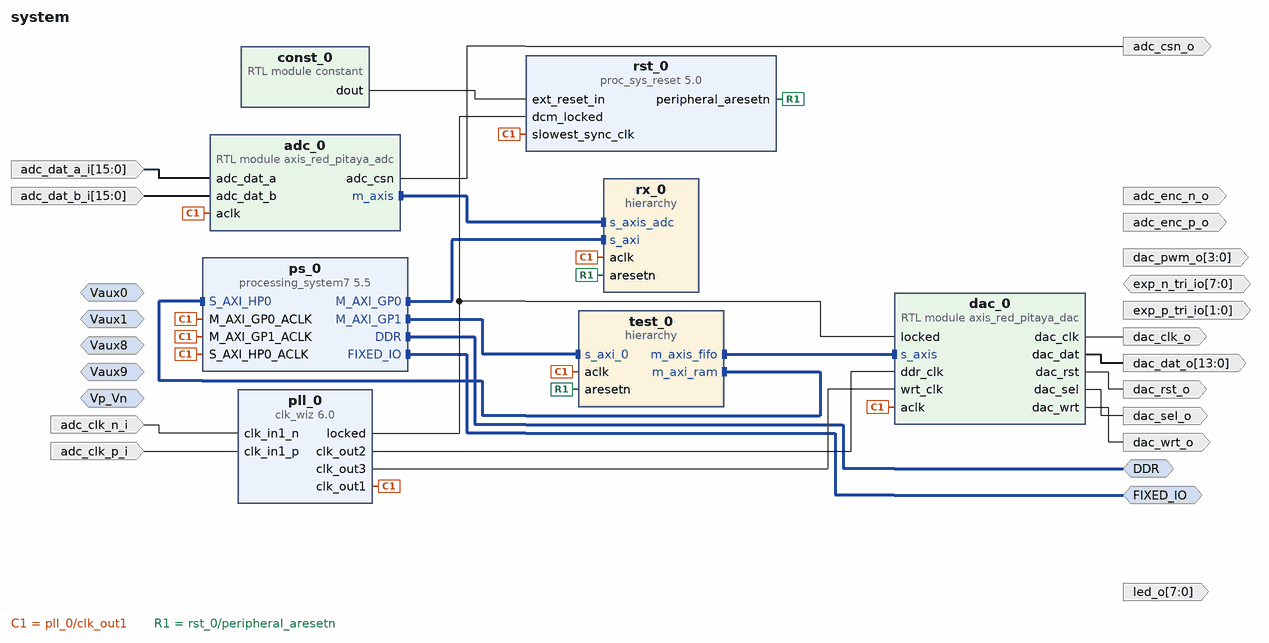
[diagram p0: block diagram of the top level]
# Vivado block design system, xc7z010clg400-1, Vivado 2025.2
create_bd_design system

create_bd_intf_port -mode Slave -vlnv xilinx.com:interface:diff_analog_io_rtl:1.0 Vp_Vn
create_bd_intf_port -mode Slave -vlnv xilinx.com:interface:diff_analog_io_rtl:1.0 Vaux0
create_bd_intf_port -mode Slave -vlnv xilinx.com:interface:diff_analog_io_rtl:1.0 Vaux1
create_bd_intf_port -mode Slave -vlnv xilinx.com:interface:diff_analog_io_rtl:1.0 Vaux9
create_bd_intf_port -mode Slave -vlnv xilinx.com:interface:diff_analog_io_rtl:1.0 Vaux8
create_bd_intf_port -mode Master -vlnv xilinx.com:interface:ddrx_rtl:1.0 DDR
create_bd_intf_port -mode Master -vlnv xilinx.com:display_processing_system7:fixedio_rtl:1.0 FIXED_IO
create_bd_port -dir I -from 15 -to 0 adc_dat_a_i
create_bd_port -dir I -from 15 -to 0 adc_dat_b_i
create_bd_port -dir I adc_clk_p_i
create_bd_port -dir I adc_clk_n_i
create_bd_port -dir O adc_enc_p_o
create_bd_port -dir O adc_enc_n_o
create_bd_port -dir O adc_csn_o
create_bd_port -dir O -from 13 -to 0 dac_dat_o
create_bd_port -dir O dac_clk_o
create_bd_port -dir O dac_rst_o
create_bd_port -dir O dac_sel_o
create_bd_port -dir O dac_wrt_o
create_bd_port -dir O -from 3 -to 0 dac_pwm_o
create_bd_port -dir IO -from 7 -to 0 exp_n_tri_io
create_bd_port -dir O -from 7 -to 0 led_o
create_bd_port -dir O -from 1 -to 0 exp_p_tri_io

create_bd_cell -type ip -vlnv xilinx.com:ip:clk_wiz:6.0 pll_0
set_property -dict [list \
  CONFIG.CLKOUT1_REQUESTED_OUT_FREQ 125.0 \
  CONFIG.CLKOUT1_USED true \
  CONFIG.CLKOUT2_REQUESTED_OUT_FREQ 250.0 \
  CONFIG.CLKOUT2_REQUESTED_PHASE 157.5 \
  CONFIG.CLKOUT2_USED true \
  CONFIG.CLKOUT3_REQUESTED_OUT_FREQ 250.0 \
  CONFIG.CLKOUT3_REQUESTED_PHASE 202.5 \
  CONFIG.CLKOUT3_USED true \
  CONFIG.PRIMITIVE PLL \
  CONFIG.PRIM_IN_FREQ 125.0 \
  CONFIG.PRIM_SOURCE Differential_clock_capable_pin \
  CONFIG.USE_RESET false \
] [get_bd_cells pll_0]
create_bd_cell -type ip -vlnv xilinx.com:ip:processing_system7:5.5 ps_0
set_property -dict [list \
  CONFIG.PCW_APU_PERIPHERAL_FREQMHZ 666.666666 \
  CONFIG.PCW_ENET0_ENET0_IO {MIO 16 .. 27} \
  CONFIG.PCW_ENET0_GRP_MDIO_ENABLE 1 \
  CONFIG.PCW_ENET0_GRP_MDIO_IO {MIO 52 .. 53} \
  CONFIG.PCW_ENET0_PERIPHERAL_ENABLE 1 \
  CONFIG.PCW_ENET0_RESET_ENABLE 0 \
  CONFIG.PCW_ENET_RESET_ENABLE 1 \
  CONFIG.PCW_ENET_RESET_SELECT {Share reset pin} \
  CONFIG.PCW_FPGA0_PERIPHERAL_FREQMHZ 50 \
  CONFIG.PCW_FPGA1_PERIPHERAL_FREQMHZ 50 \
  CONFIG.PCW_GPIO_EMIO_GPIO_ENABLE 1 \
  CONFIG.PCW_GPIO_EMIO_GPIO_IO 64 \
  CONFIG.PCW_GPIO_MIO_GPIO_ENABLE 1 \
  CONFIG.PCW_GPIO_MIO_GPIO_IO MIO \
  CONFIG.PCW_GPIO_PERIPHERAL_ENABLE 1 \
  CONFIG.PCW_I2C0_GRP_INT_ENABLE 0 \
  CONFIG.PCW_I2C0_I2C0_IO {MIO 50 .. 51} \
  CONFIG.PCW_I2C0_PERIPHERAL_ENABLE 1 \
  CONFIG.PCW_I2C_PERIPHERAL_FREQMHZ 111.111115 \
  CONFIG.PCW_I2C_RESET_ENABLE 1 \
  CONFIG.PCW_I2C_RESET_SELECT {Share reset pin} \
  CONFIG.PCW_IMPORT_BOARD_PRESET cfg/red_pitaya.xml \
  CONFIG.PCW_PRESET_BANK1_VOLTAGE {LVCMOS 2.5V} \
  CONFIG.PCW_QSPI_PERIPHERAL_ENABLE 0 \
  CONFIG.PCW_SD0_GRP_CD_ENABLE 1 \
  CONFIG.PCW_SD0_GRP_CD_IO {MIO 46} \
  CONFIG.PCW_SD0_GRP_WP_ENABLE 1 \
  CONFIG.PCW_SD0_GRP_WP_IO {MIO 47} \
  CONFIG.PCW_SD0_PERIPHERAL_ENABLE 1 \
  CONFIG.PCW_SD0_SD0_IO {MIO 40 .. 45} \
  CONFIG.PCW_SDIO_PERIPHERAL_FREQMHZ 100 \
  CONFIG.PCW_SPI0_PERIPHERAL_ENABLE 1 \
  CONFIG.PCW_SPI0_SPI0_IO EMIO \
  CONFIG.PCW_SPI1_PERIPHERAL_ENABLE 1 \
  CONFIG.PCW_SPI1_SPI1_IO {MIO 10 .. 15} \
  CONFIG.PCW_UART0_PERIPHERAL_ENABLE 1 \
  CONFIG.PCW_UART0_UART0_IO {MIO 14 .. 15} \
  CONFIG.PCW_UART1_PERIPHERAL_ENABLE 1 \
  CONFIG.PCW_UART1_UART1_IO {MIO 8 .. 9} \
  CONFIG.PCW_UART_PERIPHERAL_FREQMHZ 100 \
  CONFIG.PCW_UIPARAM_DDR_BUS_WIDTH {16 Bit} \
  CONFIG.PCW_UIPARAM_DDR_FREQ_MHZ 533.333333 \
  CONFIG.PCW_UIPARAM_DDR_PARTNO {MT41J256M16 RE-125} \
  CONFIG.PCW_USB0_PERIPHERAL_ENABLE 1 \
  CONFIG.PCW_USB0_RESET_ENABLE 1 \
  CONFIG.PCW_USB0_RESET_IO {MIO 48} \
  CONFIG.PCW_USB0_USB0_IO {MIO 28 .. 39} \
  CONFIG.PCW_USB_RESET_ENABLE 1 \
  CONFIG.PCW_USB_RESET_SELECT {Share reset pin} \
  CONFIG.PCW_USE_M_AXI_GP1 1 \
  CONFIG.PCW_USE_S_AXI_HP0 1 \
] [get_bd_cells ps_0]
# 429 more settings of ps_0 are not shown: defaults, MIO pin electricals, DDR timing, and values the tool derives
create_bd_cell -type module -reference constant const_0
create_bd_cell -type ip -vlnv xilinx.com:ip:proc_sys_reset:5.0 rst_0
create_bd_cell -type module -reference axis_red_pitaya_adc adc_0
set_property -dict {CONFIG.ADC_DATA_WIDTH 14} [get_bd_cells adc_0]
create_bd_cell -type module -reference axis_red_pitaya_dac dac_0
set_property -dict {CONFIG.DAC_DATA_WIDTH 14} [get_bd_cells dac_0]
create_bd_cell -type hier rx_0
create_bd_cell -type hier test_0

# ---- hierarchy /rx_0 ----
current_bd_instance /rx_0
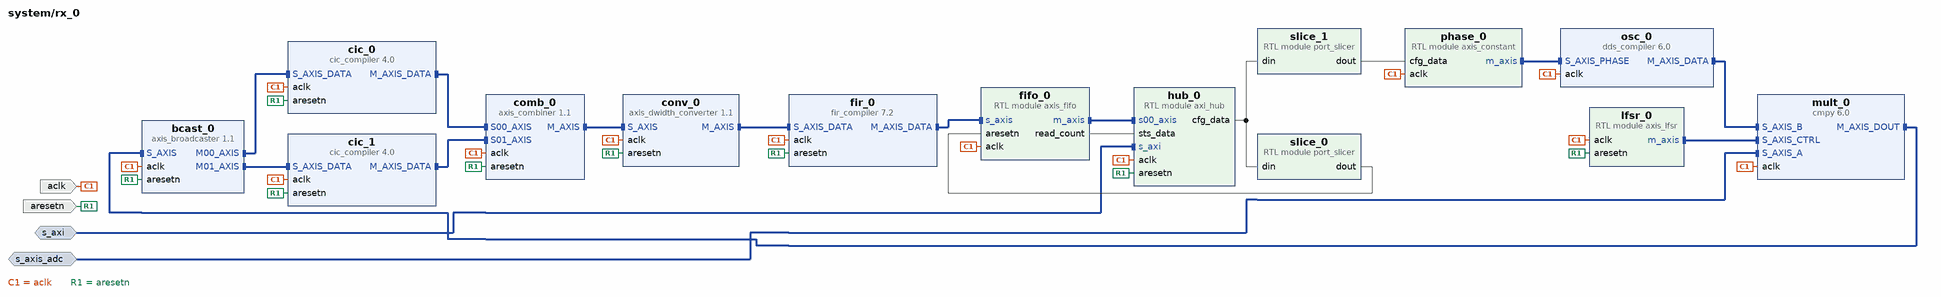
[diagram p1: block diagram inside /rx_0]
create_bd_intf_pin -mode Slave -vlnv xilinx.com:interface:aximm_rtl:1.0 s_axi
create_bd_intf_pin -mode Slave -vlnv xilinx.com:interface:axis_rtl:1.0 s_axis_adc
create_bd_pin -dir I -type clk aclk
create_bd_pin -dir I -type rst aresetn

create_bd_cell -type module -reference axi_hub hub_0
set_property -dict {CONFIG.CFG_DATA_WIDTH 64 CONFIG.STS_DATA_WIDTH 32} [get_bd_cells hub_0]
create_bd_cell -type module -reference port_slicer slice_0
set_property -dict {CONFIG.DIN_FROM 0 CONFIG.DIN_TO 0 CONFIG.DIN_WIDTH 64} [get_bd_cells slice_0]
create_bd_cell -type module -reference port_slicer slice_1
set_property -dict {CONFIG.DIN_FROM 40 CONFIG.DIN_TO 1 CONFIG.DIN_WIDTH 64} [get_bd_cells slice_1]
create_bd_cell -type module -reference axis_constant phase_0
set_property -dict {CONFIG.AXIS_TDATA_WIDTH 40} [get_bd_cells phase_0]
create_bd_cell -type ip -vlnv xilinx.com:ip:dds_compiler:6.0 osc_0
set_property -dict [list \
  CONFIG.DDS_Clock_Rate 125 \
  CONFIG.DSP48_Use Minimal \
  CONFIG.Frequency_Resolution 0.2 \
  CONFIG.Has_Phase_Out false \
  CONFIG.Negative_Sine true \
  CONFIG.Output_Width 24 \
  CONFIG.Phase_Increment Streaming \
  CONFIG.Phase_Width 30 \
  CONFIG.Resync true \
  CONFIG.Spurious_Free_Dynamic_Range 138 \
] [get_bd_cells osc_0]
create_bd_cell -type module -reference axis_lfsr lfsr_0
create_bd_cell -type ip -vlnv xilinx.com:ip:cmpy:6.0 mult_0
set_property -dict [list \
  CONFIG.APortWidth 14 \
  CONFIG.BPortWidth 24 \
  CONFIG.OutputWidth 26 \
  CONFIG.RoundMode Random_Rounding \
] [get_bd_cells mult_0]
create_bd_cell -type ip -vlnv xilinx.com:ip:axis_broadcaster:1.1 bcast_0
set_property -dict [list \
  CONFIG.HAS_TKEEP 0 \
  CONFIG.HAS_TLAST 0 \
  CONFIG.HAS_TREADY 0 \
  CONFIG.HAS_TSTRB 0 \
  CONFIG.M00_TDATA_REMAP {tdata[23:0]} \
  CONFIG.M01_TDATA_REMAP {tdata[55:32]} \
  CONFIG.M_TDATA_NUM_BYTES 3 \
  CONFIG.M_TUSER_WIDTH 0 \
  CONFIG.S_TDATA_NUM_BYTES 8 \
  CONFIG.S_TUSER_WIDTH 0 \
  CONFIG.TDEST_WIDTH 0 \
  CONFIG.TID_WIDTH 0 \
] [get_bd_cells bcast_0]
create_bd_cell -type ip -vlnv xilinx.com:ip:cic_compiler:4.0 cic_0
set_property -dict [list \
  CONFIG.Clock_Frequency 125 \
  CONFIG.Filter_Type Decimation \
  CONFIG.Fixed_Or_Initial_Rate 651 \
  CONFIG.HAS_ARESETN true \
  CONFIG.Input_Data_Width 24 \
  CONFIG.Input_Sample_Frequency 125 \
  CONFIG.Maximum_Rate 651 \
  CONFIG.Minimum_Rate 651 \
  CONFIG.Number_Of_Stages 6 \
  CONFIG.Output_Data_Width 32 \
  CONFIG.Quantization Truncation \
  CONFIG.SamplePeriod 1 \
  CONFIG.Sample_Rate_Changes Fixed \
  CONFIG.Use_Xtreme_DSP_Slice false \
] [get_bd_cells cic_0]
create_bd_cell -type ip -vlnv xilinx.com:ip:axis_combiner:1.1 comb_0
set_property -dict {CONFIG.TDATA_NUM_BYTES 4} [get_bd_cells comb_0]
create_bd_cell -type ip -vlnv xilinx.com:ip:axis_dwidth_converter:1.1 conv_0
set_property -dict {CONFIG.M_TDATA_NUM_BYTES 4 CONFIG.S_TDATA_NUM_BYTES 8} [get_bd_cells conv_0]
create_bd_cell -type ip -vlnv xilinx.com:ip:fir_compiler:7.2 fir_0
set_property -dict [list \
  CONFIG.BestPrecision true \
  CONFIG.Clock_Frequency 125 \
  CONFIG.CoefficientVector {['2.9466840486e-09, 3.3577459706e-07, 5.2774188936e-08, 5.6874919592e-07, -6.8573704542e-08, -3.5766058774e-06, -3.7445820520e-07, -2.4372735901e-06, 4.5284934196e-07, 1.7212787680e-05,', '1.4660670498e-06, 5.2674209604e-06, -1.9471646386e-06, -5.9602663375e-05, -4.3146891773e-06, -3.0964946903e-06, 6.5848523038e-06, 1.7033632291e-04, 1.0655592747e-05, -2.7046103666e-05,', '-1.9199606054e-05, -4.3242936040e-04, -2.3569186830e-05, 1.5484387454e-04, 5.1569747555e-05, 1.0349758428e-03, 4.9671241508e-05, -5.9293933382e-04, -1.3703742588e-04, -2.5156618346e-03,', '-1.1036788447e-04, 2.1448524123e-03, 4.0615851503e-04, 7.1916550197e-03, 3.4148109819e-04, -1.0021228449e-02, -1.8791964808e-03, -4.0592719623e-02, -5.5493835884e-03, 2.9353068712e-01,', '5.1371473159e-01, 2.9353068712e-01, -5.5493835884e-03, -4.0592719623e-02, -1.8791964808e-03, -1.0021228449e-02, 3.4148109819e-04, 7.1916550197e-03, 4.0615851503e-04, 2.1448524123e-03,', '-1.1036788447e-04, -2.5156618346e-03, -1.3703742588e-04, -5.9293933382e-04, 4.9671241508e-05, 1.0349758428e-03, 5.1569747555e-05, 1.5484387454e-04, -2.3569186830e-05, -4.3242936040e-04,', '-1.9199606054e-05, -2.7046103666e-05, 1.0655592747e-05, 1.7033632291e-04, 6.5848523038e-06, -3.0964946903e-06, -4.3146891773e-06, -5.9602663375e-05, -1.9471646386e-06, 5.2674209604e-06,', '1.4660670498e-06, 1.7212787680e-05, 4.5284934196e-07, -2.4372735901e-06, -3.7445820520e-07, -3.5766058774e-06, -6.8573704542e-08, 5.6874919592e-07, 5.2774188936e-08, 3.3577459706e-07, 2.9466840486e-09']} \
  CONFIG.Coefficient_Fractional_Bits 23 \
  CONFIG.Coefficient_Sets 1 \
  CONFIG.Coefficient_Sign Signed \
  CONFIG.Coefficient_Structure Inferred \
  CONFIG.Coefficient_Width 24 \
  CONFIG.ColumnConfig 1 \
  CONFIG.DATA_Has_TLAST Not_Required \
  CONFIG.Data_Width 32 \
  CONFIG.Decimation_Rate 1 \
  CONFIG.Filter_Architecture Systolic_Multiply_Accumulate \
  CONFIG.Filter_Type Single_Rate \
  CONFIG.Has_ARESETn true \
  CONFIG.Interpolation_Rate 1 \
  CONFIG.M_DATA_Has_TUSER Not_Required \
  CONFIG.Number_Channels 2 \
  CONFIG.Number_Paths 1 \
  CONFIG.Output_Rounding_Mode Convergent_Rounding_to_Even \
  CONFIG.Output_Width 32 \
  CONFIG.Quantization Quantize_Only \
  CONFIG.RateSpecification Frequency_Specification \
  CONFIG.S_DATA_Has_TUSER Not_Required \
  CONFIG.Sample_Frequency 0.0960061444 \
  CONFIG.Select_Pattern All \
  CONFIG.Zero_Pack_Factor 1 \
] [get_bd_cells fir_0]
create_bd_cell -type module -reference axis_fifo fifo_0
set_property -dict [list \
  CONFIG.ALWAYS_READY TRUE \
  CONFIG.M_AXIS_TDATA_WIDTH 32 \
  CONFIG.S_AXIS_TDATA_WIDTH 32 \
  CONFIG.WRITE_DEPTH 8192 \
] [get_bd_cells fifo_0]
create_bd_cell -type ip -vlnv xilinx.com:ip:cic_compiler:4.0 cic_1
set_property -dict [list \
  CONFIG.Clock_Frequency 125 \
  CONFIG.Filter_Type Decimation \
  CONFIG.Fixed_Or_Initial_Rate 651 \
  CONFIG.HAS_ARESETN true \
  CONFIG.Input_Data_Width 24 \
  CONFIG.Input_Sample_Frequency 125 \
  CONFIG.Maximum_Rate 651 \
  CONFIG.Minimum_Rate 651 \
  CONFIG.Number_Of_Stages 6 \
  CONFIG.Output_Data_Width 32 \
  CONFIG.Quantization Truncation \
  CONFIG.SamplePeriod 1 \
  CONFIG.Sample_Rate_Changes Fixed \
  CONFIG.Use_Xtreme_DSP_Slice false \
] [get_bd_cells cic_1]

# ---- hierarchy /test_0 ----
current_bd_instance /test_0
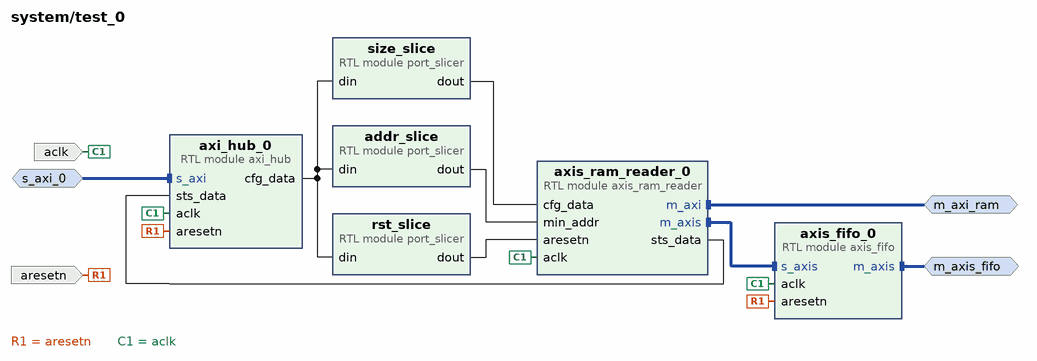
[diagram p2: block diagram inside /test_0]
create_bd_intf_pin -mode Slave -vlnv xilinx.com:interface:aximm_rtl:1.0 s_axi_0
create_bd_intf_pin -mode Master -vlnv xilinx.com:interface:aximm_rtl:1.0 m_axi_ram
create_bd_intf_pin -mode Master -vlnv xilinx.com:interface:axis_rtl:1.0 m_axis_fifo
create_bd_pin -dir I -type clk aclk
create_bd_pin -dir I -type rst aresetn

create_bd_cell -type module -reference axi_hub axi_hub_0
set_property -dict {CONFIG.CFG_DATA_WIDTH 96 CONFIG.STS_DATA_WIDTH 32} [get_bd_cells axi_hub_0]
create_bd_cell -type module -reference port_slicer rst_slice
set_property -dict {CONFIG.DIN_FROM 0 CONFIG.DIN_WIDTH 96} [get_bd_cells rst_slice]
create_bd_cell -type module -reference port_slicer addr_slice
set_property -dict {CONFIG.DIN_FROM 63 CONFIG.DIN_TO 32 CONFIG.DIN_WIDTH 96} [get_bd_cells addr_slice]
create_bd_cell -type module -reference port_slicer size_slice
set_property -dict {CONFIG.DIN_FROM 81 CONFIG.DIN_TO 64 CONFIG.DIN_WIDTH 96} [get_bd_cells size_slice]
create_bd_cell -type module -reference axis_fifo axis_fifo_0
set_property -dict {CONFIG.ALWAYS_READY TRUE CONFIG.WRITE_DEPTH 8192} [get_bd_cells axis_fifo_0]
create_bd_cell -type module -reference axis_ram_reader axis_ram_reader_0
set_property -dict [list \
  CONFIG.ADDR_WIDTH 18 \
  CONFIG.AXIS_TDATA_WIDTH 32 \
  CONFIG.AXI_ID_WIDTH 3 \
  CONFIG.FIFO_WRITE_DEPTH 1024 \
  CONFIG.MAX_OUTSTANDING 8 \
] [get_bd_cells axis_ram_reader_0]

# ---- connections ----

current_bd_instance /rx_0
connect_bd_intf_net [get_bd_intf_pins hub_0/s_axi] [get_bd_intf_pins s_axi]
connect_bd_intf_net [get_bd_intf_pins mult_0/S_AXIS_A] [get_bd_intf_pins s_axis_adc]
connect_bd_intf_net [get_bd_intf_pins cic_0/S_AXIS_DATA] [get_bd_intf_pins bcast_0/M00_AXIS]
connect_bd_intf_net [get_bd_intf_pins bcast_0/M01_AXIS] [get_bd_intf_pins cic_1/S_AXIS_DATA]
connect_bd_intf_net [get_bd_intf_pins comb_0/S00_AXIS] [get_bd_intf_pins cic_0/M_AXIS_DATA]
connect_bd_intf_net [get_bd_intf_pins cic_1/M_AXIS_DATA] [get_bd_intf_pins comb_0/S01_AXIS]
connect_bd_intf_net [get_bd_intf_pins conv_0/S_AXIS] [get_bd_intf_pins comb_0/M_AXIS]
connect_bd_intf_net [get_bd_intf_pins fir_0/S_AXIS_DATA] [get_bd_intf_pins conv_0/M_AXIS]
connect_bd_intf_net -intf_net dds_0_M_AXIS_DATA [get_bd_intf_pins mult_0/S_AXIS_B] [get_bd_intf_pins osc_0/M_AXIS_DATA]
connect_bd_intf_net [get_bd_intf_pins fir_0/M_AXIS_DATA] [get_bd_intf_pins fifo_0/s_axis]
connect_bd_intf_net [get_bd_intf_pins mult_0/S_AXIS_CTRL] [get_bd_intf_pins lfsr_0/m_axis]
connect_bd_intf_net [get_bd_intf_pins bcast_0/S_AXIS] [get_bd_intf_pins mult_0/M_AXIS_DOUT]
connect_bd_intf_net [get_bd_intf_pins osc_0/S_AXIS_PHASE] [get_bd_intf_pins phase_0/m_axis]
connect_bd_intf_net -intf_net rx_0_m_axis [get_bd_intf_pins hub_0/s00_axis] [get_bd_intf_pins fifo_0/m_axis]
connect_bd_net [get_bd_pins aclk] \
  [get_bd_pins hub_0/aclk] [get_bd_pins phase_0/aclk] [get_bd_pins osc_0/aclk] [get_bd_pins lfsr_0/aclk] \
  [get_bd_pins mult_0/aclk] [get_bd_pins bcast_0/aclk] [get_bd_pins cic_0/aclk] [get_bd_pins comb_0/aclk] \
  [get_bd_pins conv_0/aclk] [get_bd_pins fir_0/aclk] [get_bd_pins fifo_0/aclk] [get_bd_pins cic_1/aclk]
connect_bd_net [get_bd_pins aresetn] \
  [get_bd_pins hub_0/aresetn] [get_bd_pins lfsr_0/aresetn] [get_bd_pins bcast_0/aresetn] [get_bd_pins cic_0/aresetn] \
  [get_bd_pins comb_0/aresetn] [get_bd_pins conv_0/aresetn] [get_bd_pins fir_0/aresetn] [get_bd_pins cic_1/aresetn]
connect_bd_net [get_bd_pins hub_0/cfg_data] [get_bd_pins slice_1/din] [get_bd_pins slice_0/din]
connect_bd_net -net rx_0_read_count [get_bd_pins fifo_0/read_count] [get_bd_pins hub_0/sts_data]
connect_bd_net [get_bd_pins slice_0/dout] [get_bd_pins fifo_0/aresetn]
connect_bd_net [get_bd_pins slice_1/dout] [get_bd_pins phase_0/cfg_data]

current_bd_instance /test_0
connect_bd_intf_net [get_bd_intf_pins axi_hub_0/s_axi] [get_bd_intf_pins s_axi_0]
connect_bd_intf_net [get_bd_intf_pins axis_fifo_0/m_axis] [get_bd_intf_pins m_axis_fifo]
connect_bd_intf_net -intf_net axis_ram_reader_1_m_axi [get_bd_intf_pins m_axi_ram] [get_bd_intf_pins axis_ram_reader_0/m_axi]
connect_bd_intf_net -intf_net axis_ram_reader_1_m_axis [get_bd_intf_pins axis_ram_reader_0/m_axis] [get_bd_intf_pins axis_fifo_0/s_axis]
connect_bd_net [get_bd_pins addr_slice/dout] [get_bd_pins axis_ram_reader_0/min_addr]
connect_bd_net [get_bd_pins aresetn] [get_bd_pins axi_hub_0/aresetn] [get_bd_pins axis_fifo_0/aresetn]
connect_bd_net [get_bd_pins axi_hub_0/cfg_data] [get_bd_pins rst_slice/din] [get_bd_pins addr_slice/din] [get_bd_pins size_slice/din]
connect_bd_net -net axis_ram_reader_1_sts_data [get_bd_pins axis_ram_reader_0/sts_data] [get_bd_pins axi_hub_0/sts_data]
connect_bd_net -net pll_0_clk_out1 [get_bd_pins aclk] [get_bd_pins axi_hub_0/aclk] [get_bd_pins axis_fifo_0/aclk] [get_bd_pins axis_ram_reader_0/aclk]
connect_bd_net [get_bd_pins size_slice/dout] [get_bd_pins axis_ram_reader_0/cfg_data]
connect_bd_net -net slicer_reset_dout [get_bd_pins rst_slice/dout] [get_bd_pins axis_ram_reader_0/aresetn]

current_bd_instance /
connect_bd_intf_net -intf_net S00_AXI_1 [get_bd_intf_pins test_0/s_axi_0] [get_bd_intf_pins ps_0/M_AXI_GP1]
connect_bd_intf_net -intf_net S_AXIS_A_1 [get_bd_intf_pins rx_0/s_axis_adc] [get_bd_intf_pins adc_0/m_axis]
connect_bd_intf_net [get_bd_intf_ports DDR] [get_bd_intf_pins ps_0/DDR]
connect_bd_intf_net [get_bd_intf_ports FIXED_IO] [get_bd_intf_pins ps_0/FIXED_IO]
connect_bd_intf_net [get_bd_intf_pins ps_0/M_AXI_GP0] [get_bd_intf_pins rx_0/s_axi]
connect_bd_intf_net [get_bd_intf_pins test_0/m_axi_ram] [get_bd_intf_pins ps_0/S_AXI_HP0]
connect_bd_intf_net -intf_net test_0_m_axis_0 [get_bd_intf_pins dac_0/s_axis] [get_bd_intf_pins test_0/m_axis_fifo]
connect_bd_net [get_bd_pins adc_0/adc_csn] [get_bd_ports adc_csn_o]
connect_bd_net [get_bd_ports adc_clk_n_i] [get_bd_pins pll_0/clk_in1_n]
connect_bd_net [get_bd_ports adc_clk_p_i] [get_bd_pins pll_0/clk_in1_p]
connect_bd_net [get_bd_ports adc_dat_a_i] [get_bd_pins adc_0/adc_dat_a]
connect_bd_net [get_bd_ports adc_dat_b_i] [get_bd_pins adc_0/adc_dat_b]
connect_bd_net [get_bd_pins const_0/dout] [get_bd_pins rst_0/ext_reset_in]
connect_bd_net [get_bd_pins dac_0/dac_clk] [get_bd_ports dac_clk_o]
connect_bd_net [get_bd_pins dac_0/dac_dat] [get_bd_ports dac_dat_o]
connect_bd_net [get_bd_pins dac_0/dac_rst] [get_bd_ports dac_rst_o]
connect_bd_net [get_bd_pins dac_0/dac_sel] [get_bd_ports dac_sel_o]
connect_bd_net [get_bd_pins dac_0/dac_wrt] [get_bd_ports dac_wrt_o]
connect_bd_net [get_bd_pins pll_0/clk_out1] \
  [get_bd_pins ps_0/M_AXI_GP0_ACLK] [get_bd_pins rst_0/slowest_sync_clk] [get_bd_pins adc_0/aclk] [get_bd_pins dac_0/aclk] \
  [get_bd_pins rx_0/aclk] [get_bd_pins ps_0/M_AXI_GP1_ACLK] [get_bd_pins test_0/aclk] [get_bd_pins ps_0/S_AXI_HP0_ACLK]
connect_bd_net [get_bd_pins pll_0/clk_out2] [get_bd_pins dac_0/ddr_clk]
connect_bd_net [get_bd_pins pll_0/clk_out3] [get_bd_pins dac_0/wrt_clk]
connect_bd_net [get_bd_pins pll_0/locked] [get_bd_pins rst_0/dcm_locked] [get_bd_pins dac_0/locked]
connect_bd_net [get_bd_pins rst_0/peripheral_aresetn] [get_bd_pins rx_0/aresetn] [get_bd_pins test_0/aresetn]
set_property HDL_ATTRIBUTE.BMM_INFO_PROCESSOR {arm > system test_0/axi_bram_ctrl_0} [get_bd_cells ps_0]
set_property HDL_ATTRIBUTE.KEEP_HIERARCHY yes [get_bd_cells ps_0]

# ---- address map ----
assign_bd_address -offset 0x40000000 -range 1G -target_address_space [get_bd_addr_spaces ps_0/Data] [get_bd_addr_segs rx_0/hub_0/s_axi/reg0]
assign_bd_address -offset 0x80000000 -range 1G -target_address_space [get_bd_addr_spaces ps_0/Data] [get_bd_addr_segs test_0/axi_hub_0/s_axi/reg0]

set_property USER_COMMENTS.comment_4 {Enter Comments here} [get_bd_cells /rx_0/fifo_0]

validate_bd_design
save_bd_design
